# Altium schematic sheet 03-Intel_CPLD_0.SchDoc
size A3; SheetNumber: 5; SheetTotal: 7
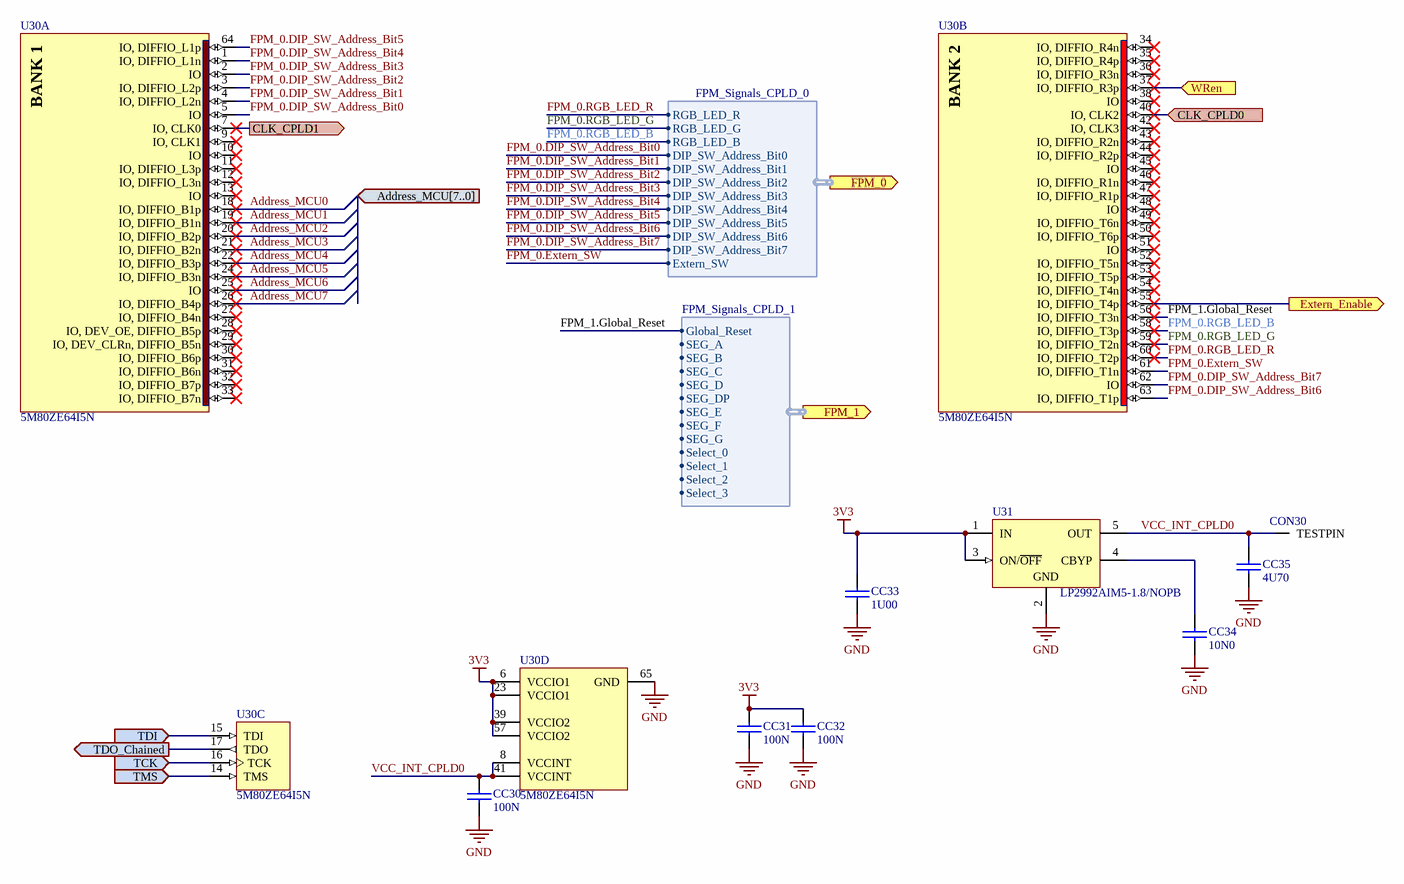
[diagram p0: 03-Intel_CPLD_0.SchDoc]

## Parts
CC30  capacitance: 100N  [0603_C]  (hidden comment: CC)
CC31  capacitance: 100N  [0603_C]  (hidden comment: CC)
CC32  capacitance: 100N  [0603_C]  (hidden comment: CC)
CC33  capacitance: 1U00  [0603_C]  (hidden comment: CC)
CC34  capacitance: 10N0  [0603_C]  (hidden comment: CC)
CC35  capacitance: 4U70  [0603_C]  (hidden comment: CC)
CON30  CON_001_M_MM000_S_X_MILL-MAX_TP  [CON_001_THT_MM000_S_D]  (value not drawn)
U30  5M80ZE64I5N  [EQFP64_A-120_D2-45_M]  (parts A,B,C,D of 4)
U31  LP2992AIM5-1.8/NOPB  [MF05A_N]

## Ports
Address_MCU[7..0] (in), CLK_CPLD0 (in), CLK_CPLD1 (out), Extern_Enable (out), FPM_0 (out, harness FPM_Signals_CPLD_0), FPM_1 (out, harness FPM_Signals_CPLD_1), TCK (in), TDI (in), TDO_Chained (out), TMS (in), WRen (in)

## Harnesses
FPM_Signals_CPLD_0: RGB_LED_R, RGB_LED_G, RGB_LED_B, DIP_SW_Address_Bit0, DIP_SW_Address_Bit1, DIP_SW_Address_Bit2, DIP_SW_Address_Bit3, DIP_SW_Address_Bit4, DIP_SW_Address_Bit5, DIP_SW_Address_Bit6, DIP_SW_Address_Bit7, Extern_SW
FPM_Signals_CPLD_1: Global_Reset, SEG_A, SEG_B, SEG_C, SEG_D, SEG_DP, SEG_E, SEG_F, SEG_G, Select_0, Select_1, Select_2, Select_3

## Nets
3V3: CC31.2 CC32.2 CC33.2 U30.6(VCCIO1) U30.23(VCCIO1) U30.39(VCCIO2) U30.57(VCCIO2) U31.1(IN) U31.3(ON/~{OFF})
GND: CC30.1 CC31.1 CC32.1 CC33.1 CC34.1 CC35.1 U30.65(GND) U31.2(GND)
Address_MCU0: U30.18(IO,_DIFFIO_B1p)
Address_MCU1: U30.19(IO,_DIFFIO_B1n)
Address_MCU2: U30.20(IO,_DIFFIO_B2p)
Address_MCU3: U30.21(IO,_DIFFIO_B2n)
Address_MCU4: U30.22(IO,_DIFFIO_B3p)
Address_MCU5: U30.24(IO,_DIFFIO_B3n)
Address_MCU6: U30.25(IO)
Address_MCU7: U30.26(IO,_DIFFIO_B4p)
CLK_CPLD0: U30.40(IO,_CLK2) ; port CLK_CPLD0
CLK_CPLD1: U30.7(IO,_CLK0) ; port CLK_CPLD1
Extern_Enable: U30.55(IO,_DIFFIO_T4p) ; port Extern_Enable
FPM_0.DIP_SW_Address_Bit0: U30.5(IO) ; port FPM_0.DIP_SW_Address_Bit0
FPM_0.DIP_SW_Address_Bit1: U30.4(IO,_DIFFIO_L2n) ; port FPM_0.DIP_SW_Address_Bit1
FPM_0.DIP_SW_Address_Bit2: U30.3(IO,_DIFFIO_L2p) ; port FPM_0.DIP_SW_Address_Bit2
FPM_0.DIP_SW_Address_Bit3: U30.2(IO) ; port FPM_0.DIP_SW_Address_Bit3
FPM_0.DIP_SW_Address_Bit4: U30.1(IO,_DIFFIO_L1n) ; port FPM_0.DIP_SW_Address_Bit4
FPM_0.DIP_SW_Address_Bit5: U30.64(IO,_DIFFIO_L1p) ; port FPM_0.DIP_SW_Address_Bit5
FPM_0.DIP_SW_Address_Bit6: U30.63(IO,_DIFFIO_T1p) ; port FPM_0.DIP_SW_Address_Bit6
FPM_0.DIP_SW_Address_Bit7: U30.62(IO) ; port FPM_0.DIP_SW_Address_Bit7
FPM_0.Extern_SW: U30.61(IO,_DIFFIO_T1n) ; port FPM_0.Extern_SW
FPM_0.RGB_LED_B: U30.58(IO,_DIFFIO_T3p) ; port FPM_0.RGB_LED_B
FPM_0.RGB_LED_G: U30.59(IO,_DIFFIO_T2n) ; port FPM_0.RGB_LED_G
FPM_0.RGB_LED_R: U30.60(IO,_DIFFIO_T2p) ; port FPM_0.RGB_LED_R
FPM_1.Global_Reset: U30.56(IO,_DIFFIO_T3n) ; port FPM_1.Global_Reset
TCK: U30.16(TCK) ; port TCK
TDI: U30.15(TDI) ; port TDI
TDO_Chained: U30.17(TDO) ; port TDO_Chained
TMS: U30.14(TMS) ; port TMS
VCC_INT_CPLD0: CC30.2 CC35.2 CON30.1(TESTPIN) U30.8(VCCINT) U30.41(VCCINT) U31.5(OUT)
WRen: U30.37(IO,_DIFFIO_R3p) ; port WRen
NetCC34_2: CC34.2 U31.4(CBYP)

Not connected (* = marked no-connect by the designer): U30 9(IO,_CLK1)* 10(IO)* 11(IO,_DIFFIO_L3p)* 12(IO,_DIFFIO_L3n)* 13(IO)* 27(IO,_DIFFIO_B4n)* 28(IO,_DEV_OE,_DIFFIO_B5p)* 29(IO,_DEV_CLRn,_DIFFIO_B5n)* 30(IO,_DIFFIO_B6p)* 31(IO,_DIFFIO_B6n)* 32(IO,_DIFFIO_B7p)* 33(IO,_DIFFIO_B7n)* 34(IO,_DIFFIO_R4n)* 35(IO,_DIFFIO_R4p)* 36(IO,_DIFFIO_R3n)* 38(IO)* 42(IO,_CLK3)* 43(IO,_DIFFIO_R2n)* 44(IO,_DIFFIO_R2p)* 45(IO)* 46(IO,_DIFFIO_R1n)* 47(IO,_DIFFIO_R1p)* 48(IO)* 49(IO,_DIFFIO_T6n)* 50(IO,_DIFFIO_T6p)* 51(IO)* 52(IO,_DIFFIO_T5n)* 53(IO,_DIFFIO_T5p)* 54(IO,_DIFFIO_T4n)*

## Notes on the sheet
- Title:
- Date:
- SVN:
- Ver:
- Sheet Size:
- A3
- Sheet Name:
- OF
- Checked By:
- Drawn By:
- Damian Szczypior
- Rev:
- Alle Rechte vorbehalten. Kopien ohne Erlaubnis der X2E GmbH sind nicht gestattet. Dieses Dokument darf ohne die Erlaubnis der X2E GmbH nicht an Dritte (auch nicht in Auszügen) weitergegeben werden .
- Sheet:
- (in symbol CMP-0217-00123-1, part A) BANK 1
- (in symbol CMP-0217-00123-1, part B) BANK 2

## Library data of the parts
CC30-CC32 = X_00000681: manufacturer: Yageo; entity_name: CC_0603_100N_50V0_10P0_X7R; entity_type_name: capacitor_ceramic; temp_coefficient: X7R; release: blocked; max_operating_temp: 125C; min_operating_temp: -55C; tolerance: 10P0; voltage_rated: 50V0; ordering_information_btm: 311-1344-6-ND; used_in_bom: 1; production_status: Aktiv; x2e_number: X_00000681; height: mm900; width: mm800; length: 1mm60; package: 0603; series: none
CC33 = X_00001611: manufacturer: Taiyo Yuden; entity_name: CC_0603_1U00_50V0_10P0_X7R; entity_type_name: capacitor_ceramic; temp_coefficient: X7R; release: blocked; max_operating_temp: 125C; min_operating_temp: -55C; tolerance: 10P0; voltage_rated: 50V0; ordering_information_btm: 587-3247-6-ND; used_in_bom: 1; production_status: Aktiv; x2e_number: X_00001611; height: mm800; width: mm800; length: 1mm60; package: 0603; series: M
CC34 = X_00000431: manufacturer: Kemet; entity_name: CC_0603_10N0_50V0_10P0_X7R; entity_type_name: capacitor_ceramic; temp_coefficient: X7R; release: blocked; max_operating_temp: 125C; min_operating_temp: -55C; tolerance: 10P0; voltage_rated: 50V0; ordering_information_btm: 399-1091-6-ND; used_in_bom: 1; production_status: Aktiv; x2e_number: X_00000431; height: mm800; width: mm800; length: 1mm60; package: 0603; series: none
CC35 = X_00002029: manufacturer: Samsung; entity_name: CC_0603_4U70_6V30_10P0_X7R; entity_type_name: capacitor_ceramic; temp_coefficient: X7R; release: blocked; max_operating_temp: 125C; min_operating_temp: -55C; tolerance: 10P0; voltage_rated: 6V30; ordering_information_btm: 1276-2087-6-ND; used_in_bom: 1; production_status: Aktiv; x2e_number: X_00002029; height: mm800; width: mm800; length: 1mm60; package: 0603; series: CL
CON30 = X_00001838: MILL-MAX_TP; ordering_information: digikey, ED90581-ND; entity_type_name: connector; release: blocked; max_operating_temp: 0C; grid: MM000; pin_count_type: X; mounting_type: S; gender: M; number_of_electronic_pins: 001; ordering_information_btm: ED90581-ND; used_in_bom: 1; production_status: Aktiv; editor_date: boos, 06.02.2014; x2e_number: X_00001838; entity_name: CON_001_M_MM000_S_X_MILL-MAX_TP; height: 5mm56; width: 3mm18; length: 3mm18; min_operating_temp: 0C; manufacturer: MILL-MAX; package: THT; shell_material: Tin; series: 2501
U30 = CMP-0217-00123-1: MAX V 1.8V CPLD, 54 IOs, 80 Logic Elements, 64-Pin EQFP, Industrial Temperature, Speed Grade 5, Pb-Free; ComponentLink2URL: http://www.altera.com/literature/hb/max-v/max5_handbook.pdf; ComponentLink4Description: Package Specification; ComponentLink1URL: http://www.altera.com/; ComponentLink1Description: Manufacturer URL; ComponentLink2Description: Datasheet; DatasheetVersion: ver1.2, May-2011; ComponentLink3URL: http://www.altera.com/literature/lit-dp.jsp?category=MAX%205&showspreadsheet=y; ComponentLink4URL: http://www.altera.com/devicepackaging/04R00384-01.pdf; Code_JEDEC: MS-026-ABD-HD; PackageVersion: ver1.0, Jul-2011; PackageDescription: 64-Pin Plastic Enhanced Quad Flat (EQFP) - Wire Bond - A:1.20 - D2:4.5; ComponentLink3Description: MAX V Device Pin-Out files; PackageReference: EQFP64_A-120_D2-45
U31 = CMP-0062-02117-2: Micropower 250 mA Low-Noise Ultra Low-Dropout Regulator, 5-pin SOT-23, Pb-Free; Manufacturer: National Semiconductor; PowerWise: N; PackageTopMarking: LFCA*XTT; CompType: LDO IC; ComponentLink1URL: http://www.national.com/ds/LP/LP2992.pdf; PinCount: 5; PackageReference: MF05A; PackageVersion: revD, Aug-2008; ComponentLink3URL: http://www.national.com/packaging/folders/mf05a.html; DatasheetVersion: May-2005; ComponentLink2URL: http://www.national.com/pf/LP/LP2992.html; RevisionNote: Component URLs added; ComponentLink2Description: LP2992 Web Page; ComponentLink1Description: LP2992 Datasheet; RoHS: Y; PackageDescription: Molded SOT-23, .115 x .063 x .040 in Body, 5 Lead, .0375 in Pitch; ComponentLink3Description: MF05A Package Page